# EAGLE design Door-inner (EAGLE 9.3.0)
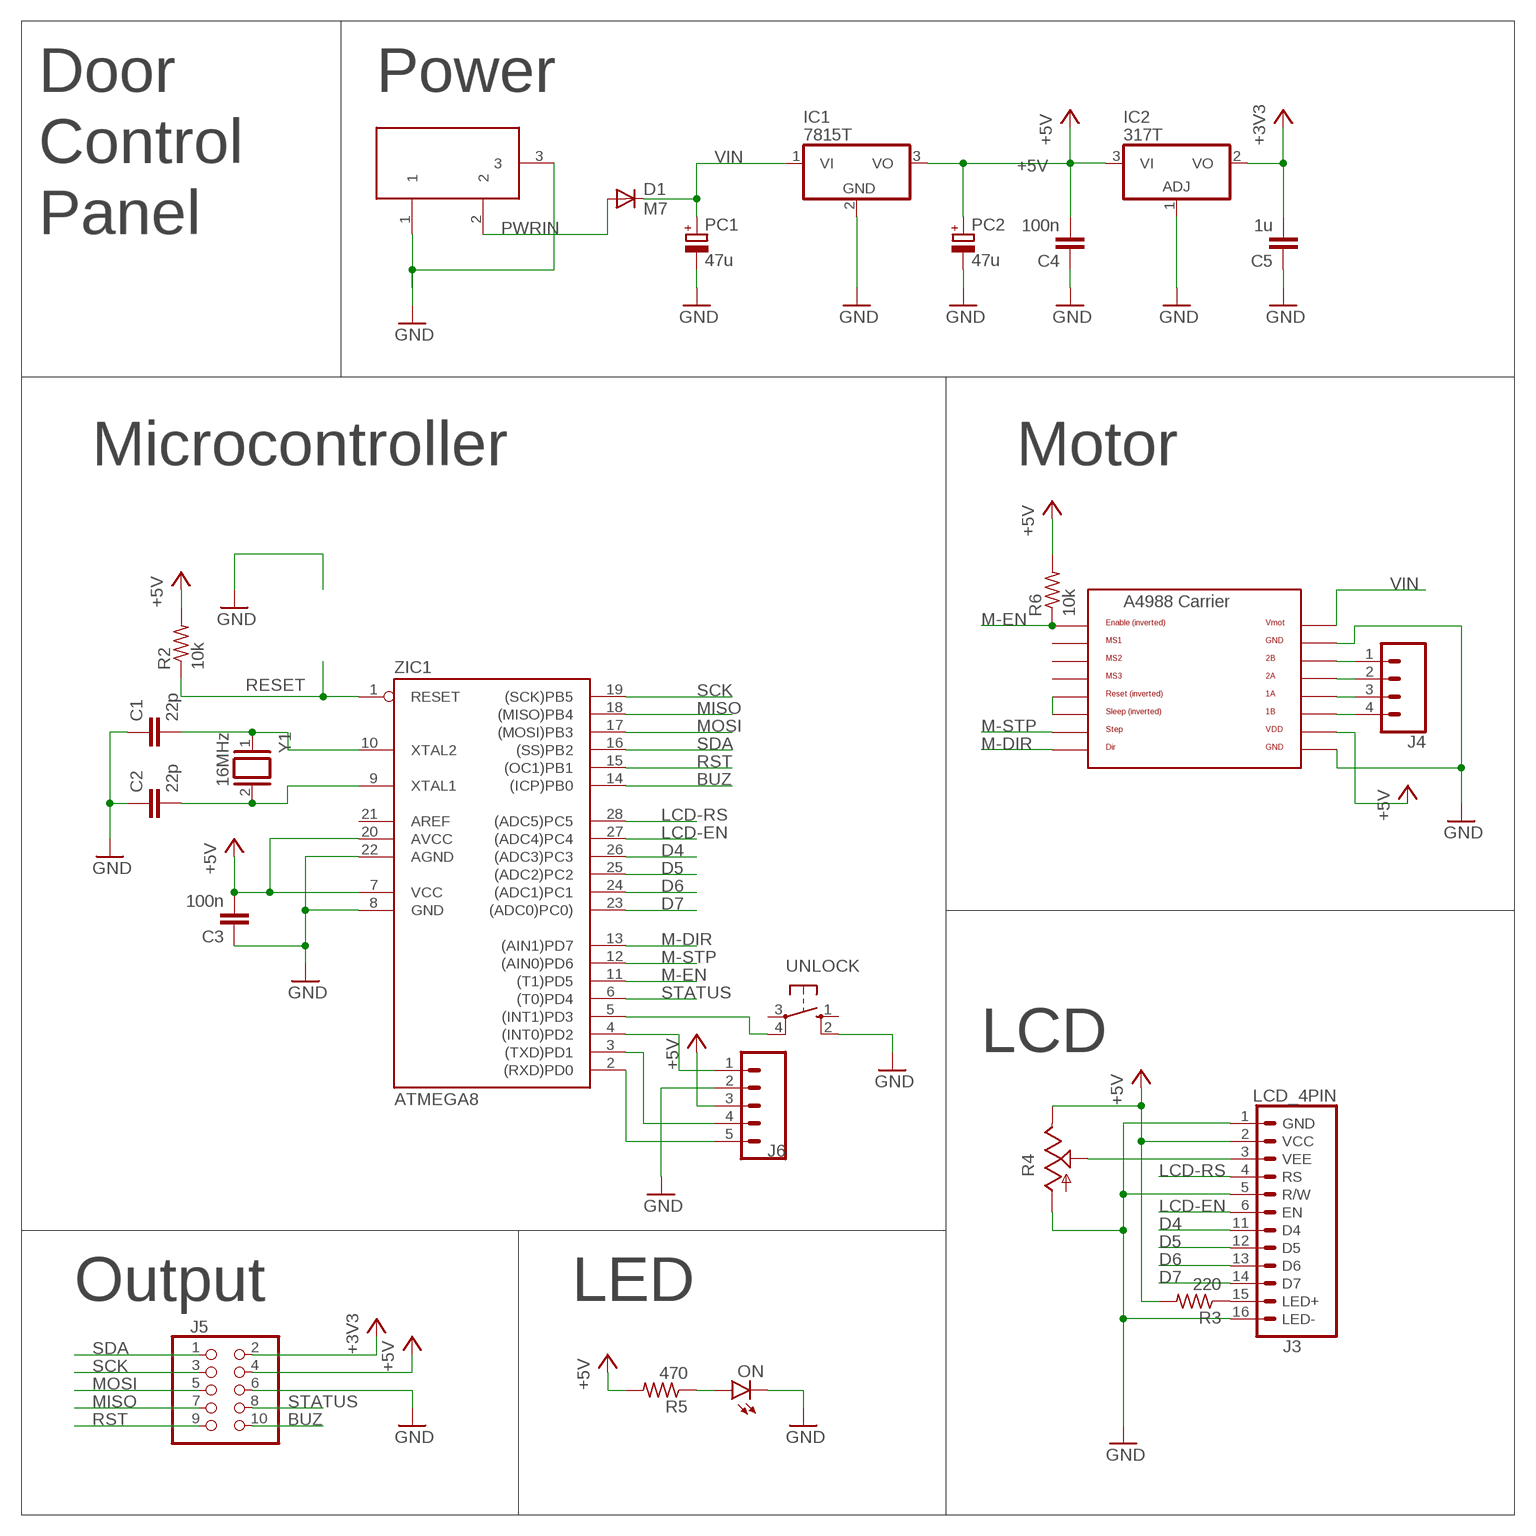
[diagram p0: schematic, sheet 1]

## Parts
C1  22p  C-EU025-030X050  [C025-030X050]
C2  22p  C-EU025-030X050  [C025-030X050]
C3  100n  C-EU050-030X075  [C050-030X075]
C4  100n  C-EU050-030X075  [C050-030X075]
C5  1u  C-EU050-030X075  [C050-030X075]
D1  M7  DIODE-D-12.5  [D-12.5]
IC1  7815T  [TO220H]
IC2  317T  [TO220H]
J3  LCD_4PIN  [LCD-16X2]
J4  CONN_04  [1X04]
J5  PINHD-2X5  [2X05]
J6  CONN_05  [1X05]
ON  LED3MM  [LED3MM]
PC1  47u  CPOL-EUTT2D5  [TT2D5]
PC2  47u  CPOL-EUTT2D5  [TT2D5]
R2  10k  R-US_0207/10  [0207/10]
R3  220  R-US_0207/10  [0207/10]
R4  TRIM_US-S63P  [S63P]
R5  470  R-US_0207/10  [0207/10]
R6  10k  R-US_0207/10  [0207/10]
U$1  A4988BREAKOUT  [A4988BREAKOUT]
UNLOCK  10-XX  [B3F-10XX]
X1  POWERSUPPLY_DC21MMX  [POWERSUPPLY_DC-21MM]
Y1  16MHz  XTAL/S  [QS]
ZIC1  ATMEGA8  AT90S4433P  [DIL28-3]

## Nets
+3V3: C5.2 IC2.2(VO) J5.2
+5V [power]: C3.2 C4.2 IC1.3(VO) IC2.3(VI) J3.2(VCC) J5.4 J6.3 PC2.+ R2.2 R3.2 R4.E R5.2 R6.2 U$1.VDD ZIC1.7(VCC) ZIC1.20(AVCC)
BUZ: J5.10 ZIC1.14((ICP)PB0)
D4: J3.11(D4) ZIC1.26((ADC3)PC3)
D5: J3.12(D5) ZIC1.25((ADC2)PC2)
D6: J3.13(D6) ZIC1.24((ADC1)PC1)
D7: J3.14(D7) ZIC1.23((ADC0)PC0))
GND [gnd]: C1.1 C2.1 C3.1 C4.1 C5.1 IC1.2(GND) IC2.1(ADJ) J3.1(GND) J3.5(R/W) J3.16(LED-) J5.6 J6.2 ON.K(C) PC1.- PC2.- R4.A U$1.GND U$1.GND@0(GND) UNLOCK.2(S1) X1.1 X1.3 ZIC1.8(GND) ZIC1.22(AGND)
LCD-EN: J3.6(EN) ZIC1.27((ADC4)PC4)
LCD-RS: J3.4(RS) ZIC1.28((ADC5)PC5)
M-DIR: U$1.DIR ZIC1.13((AIN1)PD7)
M-EN: R6.1 U$1.EN ZIC1.11((T1)PD5)
M-STP: U$1.STEP ZIC1.12((AIN0)PD6)
MISO: J5.7 ZIC1.18((MISO)PB4)
MOSI: J5.5 ZIC1.17((MOSI)PB3)
N$1: J6.1 ZIC1.4((INT0)PD2)
N$2: J6.4 ZIC1.3((TXD)PD1)
N$3: J6.5 ZIC1.2((RXD)PD0)
N$4: J3.15(LED+) R3.1
N$5: J3.3(VEE) R4.S
N$6: ON.A R5.1
N$7: U$1.RST U$1.SLP(SLEEP)
N$8: J4.1 U$1.2B
N$9: J4.2 U$1.2A
N$10: J4.3 U$1.1A
N$11: J4.4 U$1.1B
N$12: UNLOCK.4(P1) ZIC1.5((INT1)PD3)
PWRIN [vin]: D1.A X1.2
RESET: R2.1 ZIC1.1(RESET)
RST: J5.9 ZIC1.15((OC1)PB1)
SCK: J5.3 ZIC1.19((SCK)PB5)
SDA: J5.1 ZIC1.16((SS)PB2)
STATUS: J5.8 ZIC1.6((T0)PD4)
VIN [vin]: D1.C IC1.1(VI) PC1.+ U$1.VMOT
XTAL1: C2.2 Y1.2 ZIC1.9(XTAL1)
XTAL2: C1.2 Y1.1 ZIC1.10(XTAL2)
Unconnected: U$1.MS1 U$1.MS2 U$1.MS3 UNLOCK.1(S) UNLOCK.3(P) ZIC1.21(AREF)

## Notes on the sheet
- Door | Power
- Control
- Panel
- Microcontroller | Motor
- LCD
- Output | LED

## Library data of the parts
C1-C5 = resistor:C-EU: CAPACITOR, European symbol
D1 = diode:DIODE-: DIODE
IC1 = linear:78*: Positive VOLTAGE REGULATOR Source: http://cache.national.com/ds/LM/LM78L05.pdf http://www.fairchildsemi.com/ds/LM/LM7805.pdf
IC2 = linear:*317: Positive VOLTAGE REGULATOR
J3 = lcd:LCD_4PIN
J4 = SparkFun-Connectors:CONN_04: Multi connection point. Often used as Generic Header-pin footprint for 0.1 inch spaced/style header connections On any of the 0.1 inch spaced packages, you can populate with these: Break Away Headers - Straight <https://www.sparkfun.com/products/116> (PRT-00116) Break Away Male Headers - Right Angle <https://www.sparkfun.com/products/553> (PRT-00553) Female Headers <https://www.sparkfun.com/products/115> (PRT-00115) Break Away Headers - Machine Pin <https://www.sparkfun.com/products/117> (PRT-00117) Break Away Female Headers - Swiss Machine Pin <https://www.sparkfun.com/products/743> (PRT-00743) For SCREWTERMINALS and SPRING TERMINALS visit here: Screw Terimnals on SparkFun.com <https://www.sparkfun.com/search/results?term=Screw+Terminals> (5mm/3.5mm/2.54mm spacing) This device is also useful as a general connection point to wire up your design to another part of your project. Our various solder wires solder well into these plated through hole pads. Hook-Up Wire - Assortment (Stranded, 22 AWG) <https://www.sparkfun.com/products/11375> (PRT-11375) Hook-Up Wire - Assortment (Solid Core, 22 AWG) <https://www.sparkfun.com/products/11367> (PRT-11367) View the entire wire category on our website here <https://www.sparkfun.com/categories/141> Special notes: Molex polarized connector foot print use with SKU : PRT-08231 with associated crimp pins and housings. 1MM SMD Version SKU: PRT-10208; PROD_ID: CONN-09696
J5 = pinhead:PINHD-2X5: PIN HEADER
J6 = SparkFun-Connectors:CONN_05: Multi connection point. Often used as Generic Header-pin footprint for 0.1 inch spaced/style header connections On any of the 0.1 inch spaced packages, you can populate with these: Break Away Headers - Straight <https://www.sparkfun.com/products/116> (PRT-00116) Break Away Male Headers - Right Angle <https://www.sparkfun.com/products/553> (PRT-00553) Female Headers <https://www.sparkfun.com/products/115> (PRT-00115) Break Away Headers - Machine Pin <https://www.sparkfun.com/products/117> (PRT-00117) Break Away Female Headers - Swiss Machine Pin <https://www.sparkfun.com/products/743> (PRT-00743) For SCREWTERMINALS and SPRING TERMINALS visit here: Screw Terimnals on SparkFun.com <https://www.sparkfun.com/search/results?term=Screw+Terminals> (5mm/3.5mm/2.54mm spacing) This device is also useful as a general connection point to wire up your design to another part of your project. Our various solder wires solder well into these plated through hole pads. Hook-Up Wire - Assortment (Stranded, 22 AWG) <https://www.sparkfun.com/products/11375> (PRT-11375) Hook-Up Wire - Assortment (Solid Core, 22 AWG) <https://www.sparkfun.com/products/11367> (PRT-11367) View the entire wire category on our website here <https://www.sparkfun.com/categories/141> Special notes: Molex polarized connector foot print use with SKU : PRT-08231 with associated crimp pins and housings. 1MM SMD Version SKU: PRT-10208
ON = led:LED: LED OSRAM: - CHIPLED LG R971, LG N971, LY N971, LG Q971, LY Q971, LO R971, LY R971 LH N974, LH R974 LS Q976, LO Q976, LY Q976 LO Q996 - Hyper CHIPLED LW Q18S LB Q993, LB Q99A, LB R99A - SideLED LS A670, LO A670, LY A670, LG A670, LP A670 LB A673, LV A673, LT A673, LW A673 LH A674 LY A675 LS A676, LA A676, LO A676, LY A676, LW A676 LS A679, LY A679, LG A679 - Hyper Micro SIDELED® LS Y876, LA Y876, LO Y876, LY Y876 LT Y87S - SmartLED LW L88C, LW L88S LB L89C, LB L89S, LG L890 LS L89K, LO L89K, LY L89K LS L896, LA L896, LO L896, LY L896 - TOPLED LS T670, LO T670, LY T670, LG T670, LP T670 LSG T670, LSP T670, LSY T670, LOP T670, LYG T670 LG T671, LOG T671, LSG T671 LB T673, LV T673, LT T673, LW T673 LH T674 LS T676, LA T676, LO T676, LY T676, LB T676, LH T676, LSB T676, LW T676 LB T67C, LV T67C, LT T67C, LS T67K, LO T67K, LY T67K, LW E67C LS E67B, LA E67B, LO E67B, LY E67B, LB E67C, LV E67C, LT E67C LW T67C LS T679, LY T679, LG T679 LS T770, LO T770, LY T770, LG T770, LP T770 LB T773, LV T773, LT T773, LW T773 LH T774 LS E675, LA E675, LY E675, LS T675 LS T776, LA T776, LO T776, LY T776, LB T776 LHGB T686 LT T68C, LB T68C - Hyper Mini TOPLED® LB M676 - Mini TOPLED Santana® LG M470 LS M47K, LO M47K, LY M47K Source: http://www.osram.convergy.de LUXEON: - LUMILED® LXK2-PW12-R00, LXK2-PW12-S00, LXK2-PW14-U00, LXK2-PW14-V00 LXK2-PM12-R00, LXK2-PM12-S00, LXK2-PM14-U00 LXK2-PE12-Q00, LXK2-PE12-R00, LXK2-PE12-S00, LXK2-PE14-T00, LXK2-PE14-U00 LXK2-PB12-K00, LXK2-PB12-L00, LXK2-PB12-M00, LXK2-PB14-N00, LXK2-PB14-P00, LXK2-PB14-Q00 LXK2-PR12-L00, LXK2-PR12-M00, LXK2-PR14-Q00, LXK2-PR14-R00 LXK2-PD12-Q00, LXK2-PD12-R00, LXK2-PD12-S00 LXK2-PH12-R00, LXK2-PH12-S00 LXK2-PL12-P00, LXK2-PL12-Q00, LXK2-PL12-R00 Source: www.luxeon.com KINGBRIGHT: KA-3528ASYC Source: www.kingbright.com
PC1 PC2 = rcl:CPOL-EU: POLARIZED CAPACITOR, European symbol
R2 R3 R5 R6 = resistor:R-US_: RESISTOR, American symbol
R4 = pot:TRIM_US-: POTENTIOMETER
U$1 = RepRapjr:A4988BREAKOUT
UNLOCK = switch-omron:10-XX: OMRON SWITCH; MPN: B3F-1000; OC_FARNELL: 176432; OC_NEWARK: 36M3542
X1 = SmartPrj:POWERSUPPLY_DC21MM
Y1 = SmartPrj:XTAL/S: CRYSTAL
ZIC1 = atmel:AT90S4433: MICROCONTROLLER 4 Kbytes FLASH 128 bytes SRAM 256 bytes EEPROM UART 6-channel 10 bit ADC

## Net classes
0 default: clearance 0.305 mm
1 power: width 0.406 mm, clearance 0.305 mm
2 gnd: width 0.406 mm, clearance 0.305 mm
3 vin: width 1.422 mm, clearance 0.305 mm

## Board
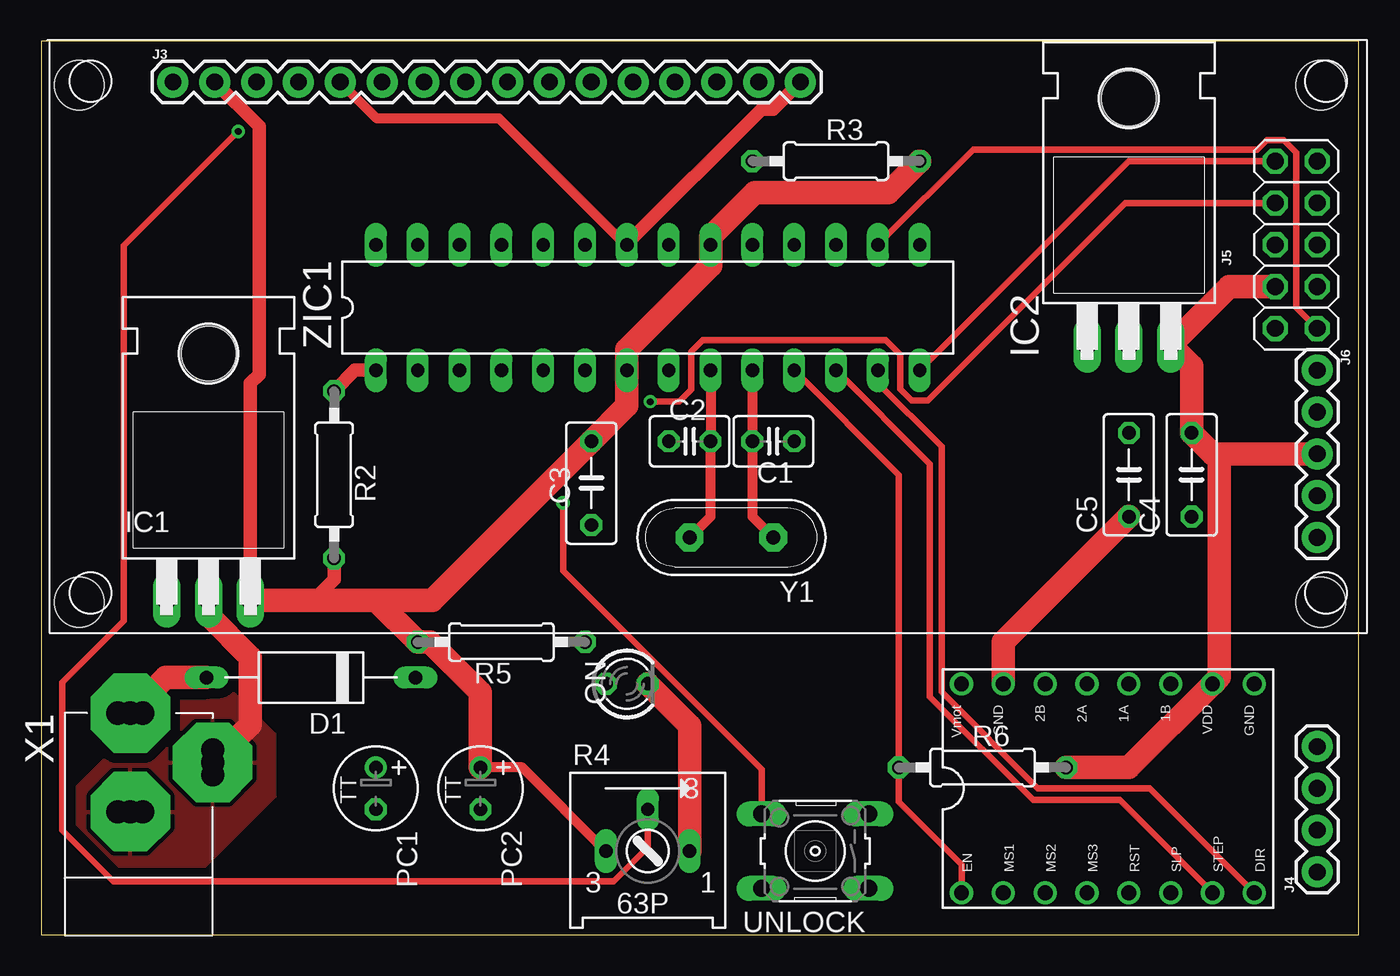
[diagram p1: board, top side]
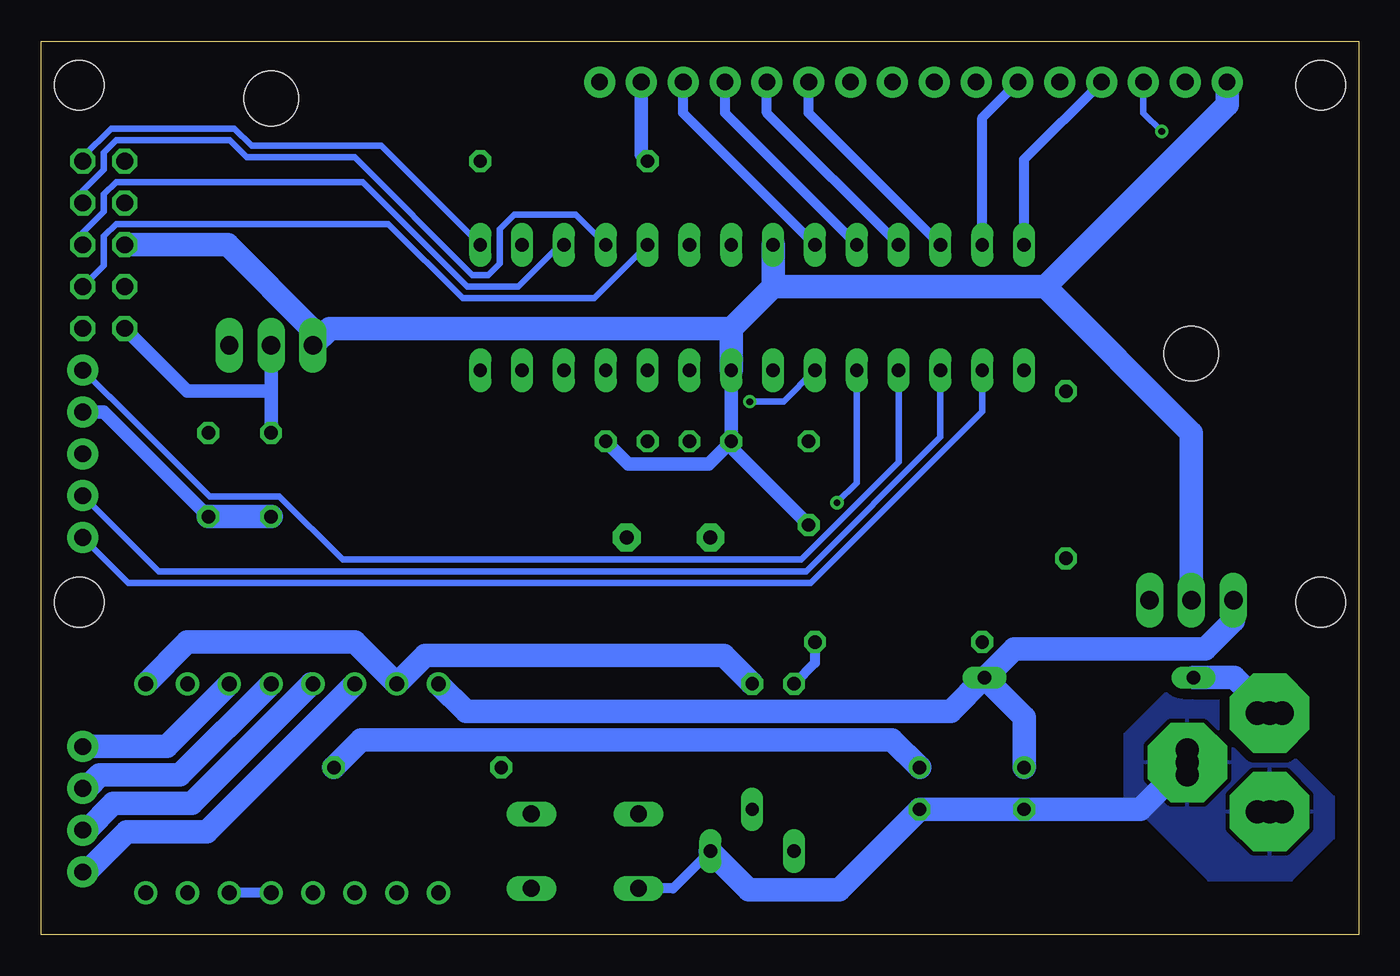
[diagram p2: board, bottom side, seen from below]

Size 80 x 54.28 mm. Coordinates in mm from the lower left corner, seen from the top.
Outline: 0,0 80,0 80,54.28 0,54.28 0,0
Copper layers (1*16): Top 0.035mm / dielectric 1.5mm / Bottom 0.035mm
Design rules "default *": minimum track width 6mil, minimum drill 0.35mm, track to track 10mil, track to pad 10mil, pad to pad 10mil, via to via 10mil, smd to smd 6mil, copper to edge 40mil, drill to drill 6mil, minimum pad ring 10mil, minimum via ring 8mil, stop-mask expansion 4mil, vias tented up to drill 0mil, thermal gap 10mil
Holes 3 mm at 2.3,20.2 77.7,20.2 77.7,51.6 2.3,51.6

### Footprints (pad centres in the part's own frame; a part is rotated, then mirrored left to right if it is on the bottom)
C025-030X050 = drill 0.813 octagon: 1 -1.27,0; 2 1.27,0
C050-030X075 = drill 0.813 octagon: 1 -2.54,0; 2 2.54,0
D-12.5 = drill 0.813 long: A 6.35,0; C -6.35,0
TO220H = drill 1.118 long: 1 -2.54,-10.16; 2 0,-10.16; 3 2.54,-10.16 | hole 3.302: 0,4.826
LCD-16X2 = drill 1.016 pad 1.88: 1 0,0; 2 2.54,0; 3 5.08,0; 4 7.62,0; 5 10.16,0; 6 12.7,0; 7 15.24,0; 8 17.78,0; 9 20.32,0; 10 22.86,0; 11 25.4,0; 12 27.94,0; 13 30.48,0; 14 33.02,0; 15 35.56,0; 16 38.1,0
1X04 = drill 1.016 pad 1.88: 1 0,0; 2 2.54,0; 3 5.08,0; 4 7.62,0
2X05 = drill 1.016 octagon: 1 -5.08,-1.27; 2 -5.08,1.27; 3 -2.54,-1.27; 4 -2.54,1.27; 5 0,-1.27; 6 0,1.27; 7 2.54,-1.27; 8 2.54,1.27; 9 5.08,-1.27; 10 5.08,1.27
1X05 = drill 1.016 pad 1.88: 1 0,0; 2 2.54,0; 3 5.08,0; 4 7.62,0; 5 10.16,0
LED3MM = drill 0.813 octagon: A -1.27,0; K 1.27,0
TT2D5 = drill 0.813: + -1.27,0 | drill 0.813 octagon: - 1.27,0
0207/10 = drill 0.813 octagon: 1 -5.08,0; 2 5.08,0
S63P = drill 0.813 long: A 2.54,0; E -2.54,0; S 0,2.54
A4988BREAKOUT = drill 0.9: 1A 8.89,1.27; 1B 11.43,1.27; 2A 6.35,1.27; 2B 3.81,1.27; DIR 16.51,-11.43; EN -1.27,-11.43; GND 16.51,1.27; GND@0 1.27,1.27; MS1 1.27,-11.43; MS2 3.81,-11.43; MS3 6.35,-11.43; RST 8.89,-11.43; SLP 11.43,-11.43; STEP 13.97,-11.43; VDD 13.97,1.27; VMOT -1.27,1.27
B3F-10XX = drill 1.016 long: 1 -3.251,2.261; 2 3.251,2.261; 3 -3.251,-2.261; 4 3.251,-2.261
POWERSUPPLY_DC-21MM = drill 1.4 pad 4.826 octagon: 1 -5.08,-3.353; 2 -0.076,-6.35; 3 -0.076,-0.356 | drill 1.4: 4 -5.08,-4.115; 5 -5.08,-2.591; 6 -0.838,-0.356; 7 0.686,-0.356; 8 -0.838,-6.35; 9 0.686,-6.35
QS = drill 0.85 pad 1.676 octagon: 1 -2.54,0; 2 2.54,0
DIL28-3 = drill 0.813 long: 1 -16.51,-3.81; 2 -13.97,-3.81; 3 -11.43,-3.81; 4 -8.89,-3.81; 5 -6.35,-3.81; 6 -3.81,-3.81; 7 -1.27,-3.81; 8 1.27,-3.81; 9 3.81,-3.81; 10 6.35,-3.81; 11 8.89,-3.81; 12 11.43,-3.81; 13 13.97,-3.81; 14 16.51,-3.81; 15 16.51,3.81; 16 13.97,3.81; 17 11.43,3.81; 18 8.89,3.81; 19 6.35,3.81; 20 3.81,3.81; 21 1.27,3.81; 22 -1.27,3.81; 23 -3.81,3.81; 24 -6.35,3.81; 25 -8.89,3.81; 26 -11.43,3.81; 27 -13.97,3.81; 28 -16.51,3.81

### Placement (x,y rotation side)
C1  44.45,29.97 180 top
C2  39.37,29.97 0 top
C3  33.4,27.43 90 top
C4  69.85,27.94 90 top
C5  66.04,27.94 90 top
D1  16.38,15.62 180 top
IC1  10.16,30.48 0 top
IC2  66.04,45.97 0 top
J3  8,51.8 0 top
J4  77.47,3.81 90 top
J5  76.2,41.91 90 top
J6  77.47,34.29 270 top
ON  35.56,15.24 0 top
PC1  20.32,8.89 270 top
PC2  26.67,8.89 270 top
R2  17.78,27.94 270 top
R3  48.26,46.99 0 top
R4  36.83,5.08 0 top
R5  27.94,17.78 180 top
R6  57.15,10.16 0 top
U$1  57.15,13.97 0 top
UNLOCK  46.99,5.08 180 top
X1  5.33,7.11 180 top
Y1  41.91,24.13 180 top
ZIC1  36.83,38.1 0 top

### Tracks (layer width: path | path; a pad name or v marks a point on that pad's centre or on a via)
+3V3
  Bottom 0.813: C5.2 66.04,33.02 | 66.04,33.02 IC2.2 | 66.04,33.02 71.12,33.02 J5.2
+5V
  Top 0.61: R4.E 29.21,10.16 PC2.+
  Top 0.813: R2.2 17.78,21.59 16.51,20.32 | IC1.3 12.7,33.5 13.23,34.03 13.23,49.11 J3.2
  Top 1.422: IC1.3 16.51,20.32 20.32,20.32 | 20.32,20.32 R5.2 23.61,17.78 26.67,14.71 PC2.+ | 20.32,20.32 23.75,20.32 C3.2 35.56,32.13 ZIC1.7 35.56,35.56 40.64,40.64 ZIC1.20 40.64,42.4 43.32,45.09 51.44,45.09 R3.2 | J5.4 72.14,39.37 IC2.3 69.85,34.54 C4.2 71.12,29.21 71.53,29.21 | 71.53,29.21 J6.3 | 71.53,29.21 71.53,15.65 U$1.VDD 66.04,10.16 R6.2
  Bottom 1.422: PC2.+ 28.35,11.84 60.55,11.84 R6.2
BUZ
  Top 0.406: ZIC1.14 66.04,46.99 J5.10
D4
  Bottom 0.61: ZIC1.26 33.4,49.91 J3.11
D5
  Bottom 0.61: ZIC1.25 35.94,49.91 J3.12
D6
  Bottom 0.61: ZIC1.24 38.48,49.91 J3.13
D7
  Bottom 0.61: ZIC1.23 41.02,49.91 J3.14
GND
  Top 0.61: J3.5 20.38,49.59 27.8,49.59 35.48,41.91 ZIC1.22
  Top 0.813: ZIC1.22 35.56,41.97 43.74,50.15 44.45,50.15 J3.16
  Top 1.422: X1.1 12.7,12.75 12.7,16.86 10.16,19.4 IC1.2 | ON.K 39.37,12.7 R4.A | U$1.GND@0 58.42,17.78 C5.1
  Bottom 0.61: R4.A 41.63,2.82 UNLOCK.2
  Bottom 0.813: C3.1 38.1,29.59 C2.1 | C2.1 ZIC1.8 | C1.1 44.35,28.6 39.47,28.6 C2.1 | C4.1 76.2,31.75 J6.2
  Bottom 1.016: ON.K 36.88,15.29
  Bottom 1.422: X1.1 13.26,7.62 PC1.- PC2.- 31.55,2.74 37.03,2.74 R4.A | ZIC1.8 38.1,36.83 | 35.56,39.37 ZIC1.22 | 38.1,36.83 35.56,39.37 | 35.56,39.37 19.05,39.37 | IC1.2 10.16,30.48 19.05,39.37 | 38.1,36.83 62.48,36.83 IC2.1 63.5,36.73 68.68,41.91 J5.6 | U$1.GND 71.12,17.78 60.96,17.78 U$1.GND@0 56.69,16.97 38.56,16.97 36.88,15.29 | C4.1 C5.1 | J3.1 8,50.42 19.05,39.37
  pour Top (isolate 0.61): 1.52,5.84 4.06,3.3 9.14,3.3 14.22,8.38 14.22,12.19 11.68,14.73 7.87,14.73 1.52,8.38
  pour Bottom (isolate 0.61): 1.52,5.84 4.06,3.3 9.14,3.3 14.22,8.38 14.22,12.19 11.68,14.73 7.87,14.73 1.52,8.38
LCD-EN
  Bottom 0.61: ZIC1.27 22.86,49.64 J3.6
LCD-RS
  Bottom 0.61: ZIC1.28 20.32,47.1 J3.4
M-DIR
  Top 0.406: U$1.DIR 67.31,8.89 60.52,8.89 54.67,14.74 54.67,29.64 50.8,33.51 ZIC1.13
M-EN
  Top 0.406: ZIC1.11 52.07,27.94 R6.1 52.07,8.07 55.88,4.26 U$1.EN
M-STP
  Top 0.406: U$1.STEP 65.48,8.18 60.22,8.18 53.96,14.44 53.96,28.59 ZIC1.12
MISO
  Bottom 0.406: ZIC1.18 47.55,43.74 51.28,43.74 52.17,42.85 52.17,40.77 52.86,40.08 53.82,40.08 60.96,47.22 67.52,47.22 68.56,48.26 75.46,48.26 76.2,47.52 76.2,46.46 77.47,45.19 J5.7
MOSI
  Bottom 0.406: ZIC1.17 48.49,41.91 51.03,39.37 54.12,39.37 60.47,45.72 75.46,45.72 76.2,44.98 76.2,43.92 77.47,42.65 J5.5
N$1
  Bottom 0.406: J6.1 75.84,32.66 75.82,32.66 69.78,26.62 65.53,26.62 61.7,22.78 33.86,22.78 27.94,28.7 ZIC1.4
N$2
  Bottom 0.406: J6.4 72.87,22.07 33.56,22.07 25.4,30.23 ZIC1.3
N$3
  Bottom 0.406: J6.5 74.7,21.36 33.27,21.36 22.86,31.77 ZIC1.2
N$4
  Bottom 0.813: R3.1 43.56,47.37 J3.15
N$5  (via drill 0.4)
  Top 0.406: R4.S 36.83,5.31 34.77,3.25 4.37,3.25 1.27,6.35 1.27,15.32 5.02,19.07 5.02,41.85 v11.97,48.8
  Bottom 0.406: v11.97,48.8 13.08,49.91 J3.3
N$6
  Bottom 0.61: R5.1 33.02,16.51 ON.A
N$7
  Bottom 0.61: U$1.RST U$1.SLP
N$8
  Bottom 1.422: U$1.2B 69.95,6.25 74.81,6.25 77.24,3.81 J4.1
N$9
  Bottom 1.422: U$1.2A 63.6,15.24 70.86,7.98 75.62,7.98 77.24,6.35 J4.2
N$10
  Bottom 1.422: U$1.1A 71.58,9.7 76.43,9.7 77.24,8.89 J4.3
N$11
  Bottom 1.422: U$1.1B 72.39,11.43 J4.4
N$12  (via drill 0.4)
  Top 0.406: UNLOCK.4 43.74,10.05 31.68,22.11 v31.68,26.25
  Bottom 0.406: v31.68,26.25 30.48,27.45 ZIC1.5
PWRIN
  Top 1.422: X1.2 7.57,15.62 D1.A
  Bottom 1.422: X1.2 7.57,15.62 D1.A
RESET
  Top 0.813: R2.1 19.05,34.29 ZIC1.1
RST
  Bottom 0.406: ZIC1.15 59.36,47.93 67.23,47.93 68.27,48.97 75.75,48.97 77.47,47.25 J5.9
SCK
  Bottom 0.406: J5.3 76.2,40.64 76.2,42.44 75.46,43.18 58.93,43.18 54.41,38.66 46.43,38.66 ZIC1.19
SDA
  Top 0.406: ZIC1.16 56.59,47.7 73.84,47.7 74.4,48.26 75.46,48.26 76.2,47.52 76.2,38.1 J5.1
STATUS  (via drill 0.4)
  Top 0.406: v36.98,32.38 38.73,32.38 39.47,33.12 39.47,35.43 40.16,36.12 51.28,36.12 52.17,35.23 52.17,33.15 52.86,32.46 53.82,32.46 65.81,44.45 J5.8
  Bottom 0.406: ZIC1.6 34.92,32.38 v36.98,32.38
VIN
  Bottom 1.422: D1.C 24.79,13.56 54.2,13.56 U$1.VMOT | IC1.1 7.62,19.05 9.32,17.35 20.92,17.35 22.65,15.62 D1.C | PC1.+ 20.32,13.21 D1.C
XTAL1
  Top 0.61: ZIC1.9 C2.2 40.64,25.4 Y1.2
XTAL2
  Top 0.61: ZIC1.10 C1.2 43.18,25.4 Y1.1

### Text on the board
Document: Door Rev. 1.3.0